# Altium schematic sheet KlusterLab HMI.SchDoc
size A3; SheetNumber: 1; SheetTotal: 1
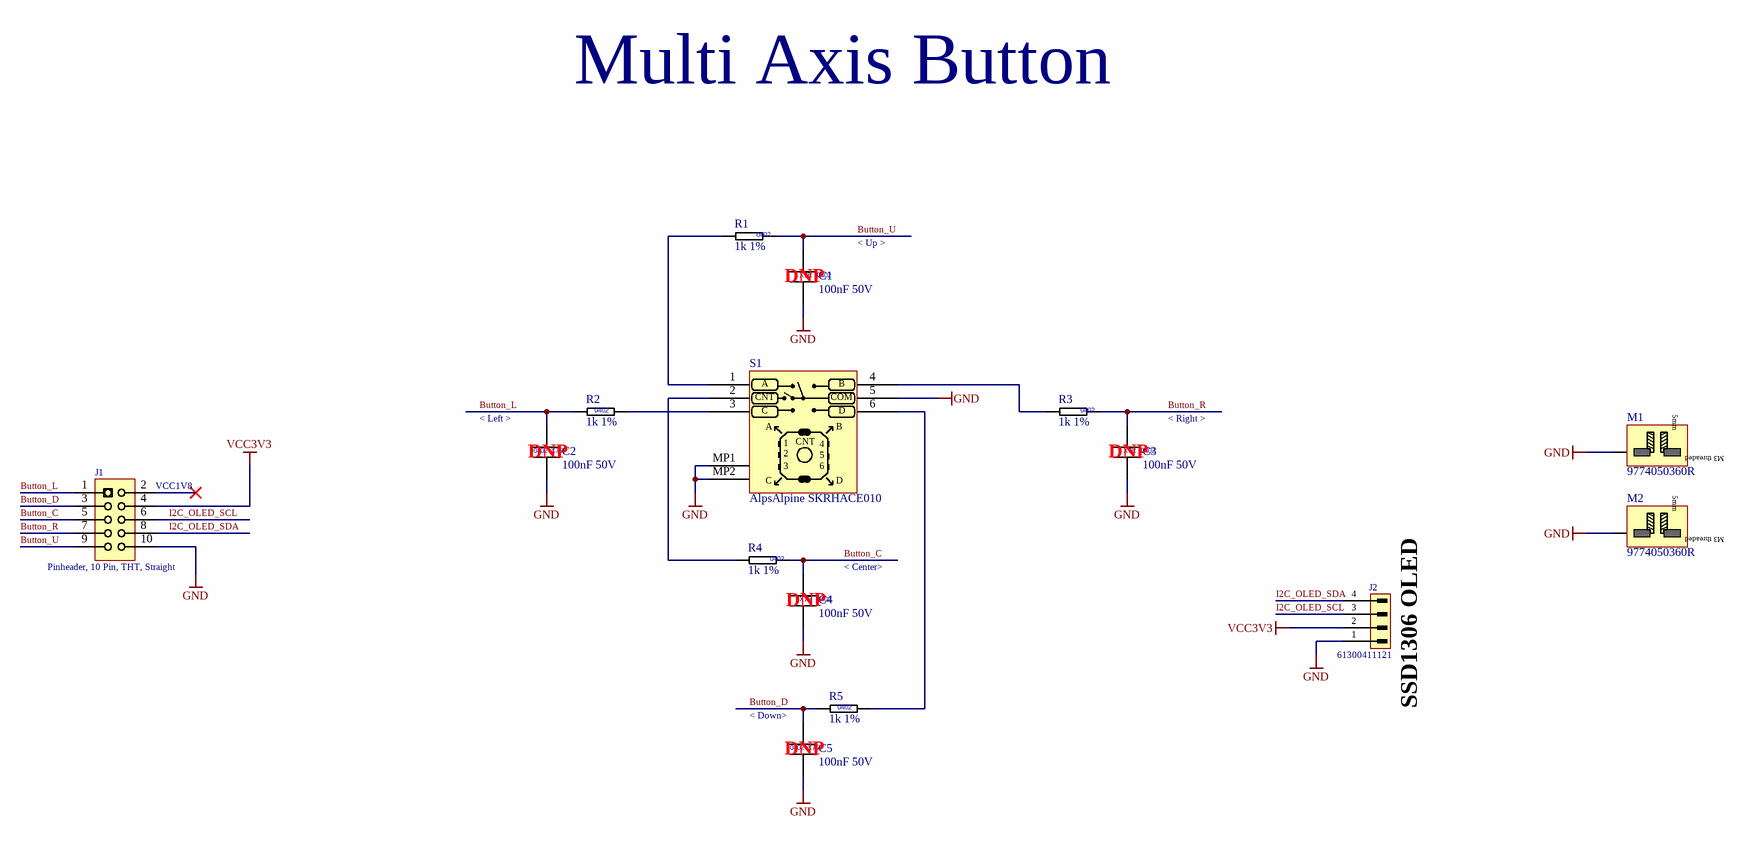
[diagram p0: KlusterLab HMI.SchDoc]

## Parts
C1  100nF 50V  [CAP_0402_L]  (no BOM)
C2  100nF 50V  [CAP_0402_L]  (no BOM)
C3  100nF 50V  [CAP_0402_L]  (no BOM)
C4  100nF 50V  [CAP_0402_L]  (no BOM)
C5  100nF 50V  [CAP_0402_L]  (no BOM)
J1  Pinheader, 10 Pin, THT, Straight  [62701021621]
J2  Symbol Text: 61300411121  [WE_61300411121]  (hidden comment: WE / WR-PHD / 61300411121 / PinHeader / 1x4 Pin / RM2.54 / Top Entry / Male)
M1  9774050360R  [9774050360R]
M2  9774050360R  [9774050360R]
R1  1k 1%  [RES_0402_L]
R2  1k 1%  [RES_0402_L]
R3  1k 1%  [RES_0402_L]
R4  1k 1%  [RES_0402_L]
R5  1k 1%  [RES_0402_L]
S1  AlpsAlpine SKRHACE010  [AlpsAlpine_SKRHACE010]

## Nets
GND: C1.2 C2.2 C3.2 C4.2 C5.2 J1.10 J2.1 M1.1 M2.1 S1.5 S1.MP1 S1.MP2
VCC3V3: J1.4 J2.2
Button_C: C4.1 J1.5 R4.1
Button_D: C5.1 J1.3 R5.1
Button_L: C2.1 J1.1 R2.1
Button_R: C3.1 J1.7 R3.1
Button_U: C1.1 J1.9 R1.1
I2C_OLED_SCL: J1.6 J2.3
I2C_OLED_SDA: J1.8 J2.4
NetR1_2: R1.2 S1.1
NetR2_2: R2.2 S1.3
NetR3_2: R3.2 S1.4
NetR4_2: R4.2 S1.2
NetR5_2: R5.2 S1.6

Not connected (* = marked no-connect by the designer): J1 2*

## Notes on the sheet
- Multi Axis Button
- < Up >
- (near C1) DNP
- (near C2) < Left >
- (near C3) < Right >
- (near J1) VCC1V8
- (near C2) DNP
- (near C3) DNP
- < Center>
- (near C4) DNP
- < Down>
- (near J2) SSD1306 OLED
- (near C5) DNP
- Company:
- Contact:
- Customer:
- mail@pcb-arts.com
- PCB Arts GmbH
- Title:
- Project:
- The  information  contained  in  these  documents  is  confidential,  privileged  and  only  for  the information of the intended recipient and may not be used, published or redistributed Without the prior written consent from PCB Arts GmbH.
- Engineer:
- Document Number:
- Revision:
- Variant:
- Date:
- Time:
- Sheet:
- Status:
- /
- (in symbol AlpsAlpine_ SKRHACE010_Multi-Directional-Switches_4-directions_center-push) A; B; CNT; COM; C; D
- (in symbol CAP_0402_100nF_50V) 0402; X7R
- (in symbol RES_0402_1k_1%) 0402
- (in symbol Würth Standoff M3 h:5mm) 5mm; M3 threaded

## Library data of the parts
C1-C5 = CAP_0402_100nF_50V: Multilayer Ceramic Capacitors MLCC - SMD/SMT 0402 50VDC; Manufacturer 1: Murata Electronics; Manufacturer 1 Prt. Nr.: GCM155L8EH104KE07D; Manufacturer 2 Prt. Nr.: UMK105B7104KV-FR; Manufacturer 2: TDK
J1 = 62701021621_Box Pin header THT 1.27mm 10Pol Straight: Box Pin header THT 1.27mm 10Pol Straight; Manufacturer 1: Würth Elektronik; Manufacturer 1 Prt. Nr.: 62701021621
J2 = CMP-CON-000024-2: WR-PHD Pin Header; Manufacturer 1: Wuerth Elektronik; Min Operating Temperature: -40°C; Max Operating Temperature: 105°C; Pin Count: 4; Gender: Male; Value: 61300411121; Manufacturer 1 Prt. Nr.: 61300411121; Mount: Surface Mount; Entry Direction: Top Entry
M1 M2 = Würth Standoff M3 h:5mm: Würth Standoff M3 h:5mm 9774050360R; Manufacturer 1: Würth Elektronik; Manufacturer 1 Prt. Nr.: 9774050360R
R1-R5 = RES_0402_1k_1%: Thick Film Resistors - SMD 1kOhm 1%; Manufacturer 1: Vishay / Dale; Manufacturer 1 Prt. Nr.: CRCW04021K00FKEDC; Manufacturer 2 Prt. Nr.: RC0402FR-7W1KL; Manufacturer 2: Yageo
S1 = AlpsAlpine_ SKRHACE010_Multi-Directional-Switches_4-directions_center-push: Multi-Directional Switches, 4-directions, center-push; Manufacturer 1 Prt. Nr.: SKRHACE010; Manufacturer 1: Alps Alpine